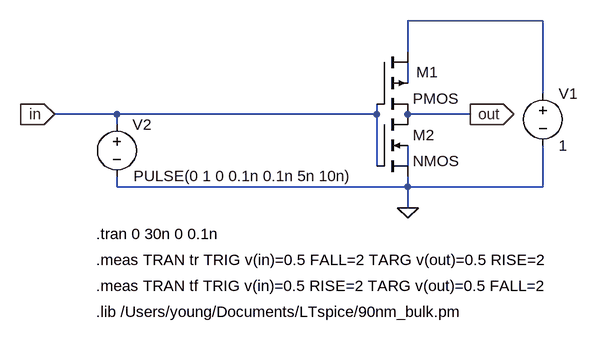
[diagram p0: schematic inv.asc]
inv.asc, the LTspice schematic file:
Version 4
SHEET 1 880 680
WIRE 208 -320 0 -320
WIRE 0 -272 0 -320
WIRE 0 -224 0 -256
WIRE 208 -208 208 -320
WIRE -448 -176 -544 -176
WIRE -48 -176 -48 -192
WIRE -48 -176 -448 -176
WIRE 96 -176 0 -176
WIRE -448 -160 -448 -176
WIRE -48 -96 -48 -176
WIRE 0 -96 0 -128
WIRE -448 -64 -448 -80
WIRE 0 -64 0 -80
WIRE 0 -64 -448 -64
WIRE 208 -64 208 -128
WIRE 208 -64 0 -64
WIRE 0 -32 0 -64
FLAG -544 -176 in
IOPIN -544 -176 In
FLAG 96 -176 out
IOPIN 96 -176 Out
FLAG 0 -32 0
SYMBOL pmos4 -48 -272 R0
WINDOW 0 61 31 Left 2
SYMATTR InstName M1
SYMATTR Value2 l=200N w=400N
SYMBOL nmos4 -48 -176 R0
SYMATTR InstName M2
SYMATTR Value2 l=200N w=200N
SYMBOL voltage 208 -224 R0
WINDOW 123 0 0 Left 0
WINDOW 39 0 0 Left 0
SYMATTR InstName V1
SYMATTR Value 1
SYMBOL voltage -448 -176 R0
WINDOW 3 26 95 Left 2
WINDOW 123 0 0 Left 0
WINDOW 39 0 0 Left 0
SYMATTR Value PULSE(0 1 0 0.1n 0.1n 5n 10n)
SYMATTR InstName V2
TEXT -480 8 Left 2 !.tran 0 30n 0 0.1n
TEXT -480 48 Left 2 !.meas TRAN tr TRIG v(in)=0.5 FALL=2 TARG v(out)=0.5 RISE=2
TEXT -480 88 Left 2 !.meas TRAN tf TRIG v(in)=0.5 RISE=2 TARG v(out)=0.5 FALL=2
TEXT -480 128 Left 2 !.lib /Users/young/Documents/LTspice/90nm_bulk.pm

The netlist it stands for:
* inv.asc
M1 N001 in out N002 PMOS l=200N w=400N
M2 out in 0 N003 NMOS l=200N w=200N
V1 N001 0 1
V2 in 0 PULSE(0 1 0 0.1n 0.1n 5n 10n)
.model NMOS NMOS
.model PMOS PMOS
.lib standard.mos
.tran 0 30n 0 0.1n
.meas TRAN tr TRIG v(in)=0.5 FALL=2 TARG v(out)=0.5 RISE=2
.meas TRAN tf TRIG v(in)=0.5 RISE=2 TARG v(out)=0.5 FALL=2
.lib /Users/young/Documents/LTspice/90nm_bulk.pm
.backanno
.end